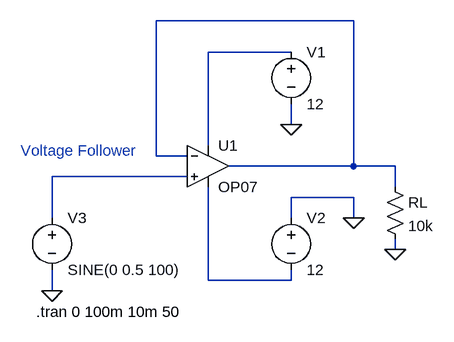
[diagram p0: schematic Voltage Follower.asc]
Voltage Follower.asc, the LTspice schematic file:
Version 4
SHEET 1 880 680
WIRE 336 -64 32 -64
WIRE 240 -16 112 -16
WIRE 240 96 240 64
WIRE 112 128 112 -16
WIRE 32 144 32 -64
WIRE 80 144 32 144
WIRE 336 160 336 -64
WIRE 336 160 144 160
WIRE 400 160 336 160
WIRE 80 176 -128 176
WIRE 400 192 400 160
WIRE 336 208 240 208
WIRE -128 240 -128 176
WIRE 240 240 240 208
WIRE 336 240 336 208
WIRE 400 288 400 272
WIRE 112 336 112 192
WIRE 240 336 240 320
WIRE 240 336 112 336
WIRE -128 352 -128 320
FLAG 240 96 0
FLAG 336 240 0
FLAG -128 352 0
FLAG 400 288 0
SYMBOL OpAmps\\OP07 112 96 R0
SYMATTR InstName U1
SYMBOL voltage 240 -32 R0
SYMATTR InstName V1
SYMATTR Value 12
SYMBOL voltage 240 224 R0
SYMATTR InstName V2
SYMATTR Value 12
SYMBOL voltage -128 224 R0
WINDOW 123 0 0 Left 0
WINDOW 39 0 0 Left 0
SYMATTR InstName V3
SYMATTR Value SINE(0 0.5 100)
SYMBOL res 384 176 R0
SYMATTR InstName RL
SYMATTR Value 10k
TEXT -152 384 Left 2 !.tran 0 100m 10m 50
TEXT -176 136 Left 2 ;Voltage Follower

The netlist it stands for:
* Voltage Follower.asc
XU1 N003 N001 N002 N004 N001 LT1001  ; OP07, pins In+ In- V+ V- OUT
V1 N002 0 12
V2 0 N004 12
V3 N003 0 SINE(0 0.5 100)
RL N001 0 10k
.tran 0 100m 10m 50
* Voltage Follower
.lib LTC.lib
.backanno
.end